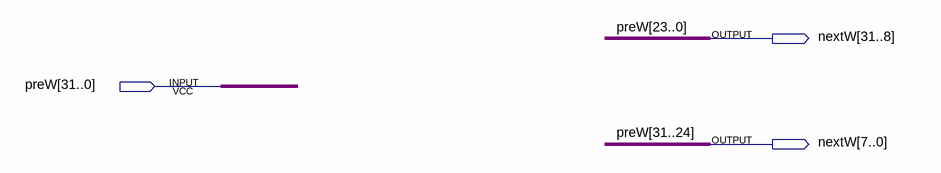
[diagram p0: schematic sheet]
// Quartus schematic RotWord.bdf as structural Verilog: 0 symbols, 3 pins
module RotWord (
  input  [31:0] preW,
  output [31:0] nextW
);


  assign nextW = {preW[23:0], preW[31:24]};
endmodule
